# Altium schematic sheet schematic_A.SchDoc: AD9913, AD8302 Interface
size A4; SheetNumber: 1; SheetTotal: 3
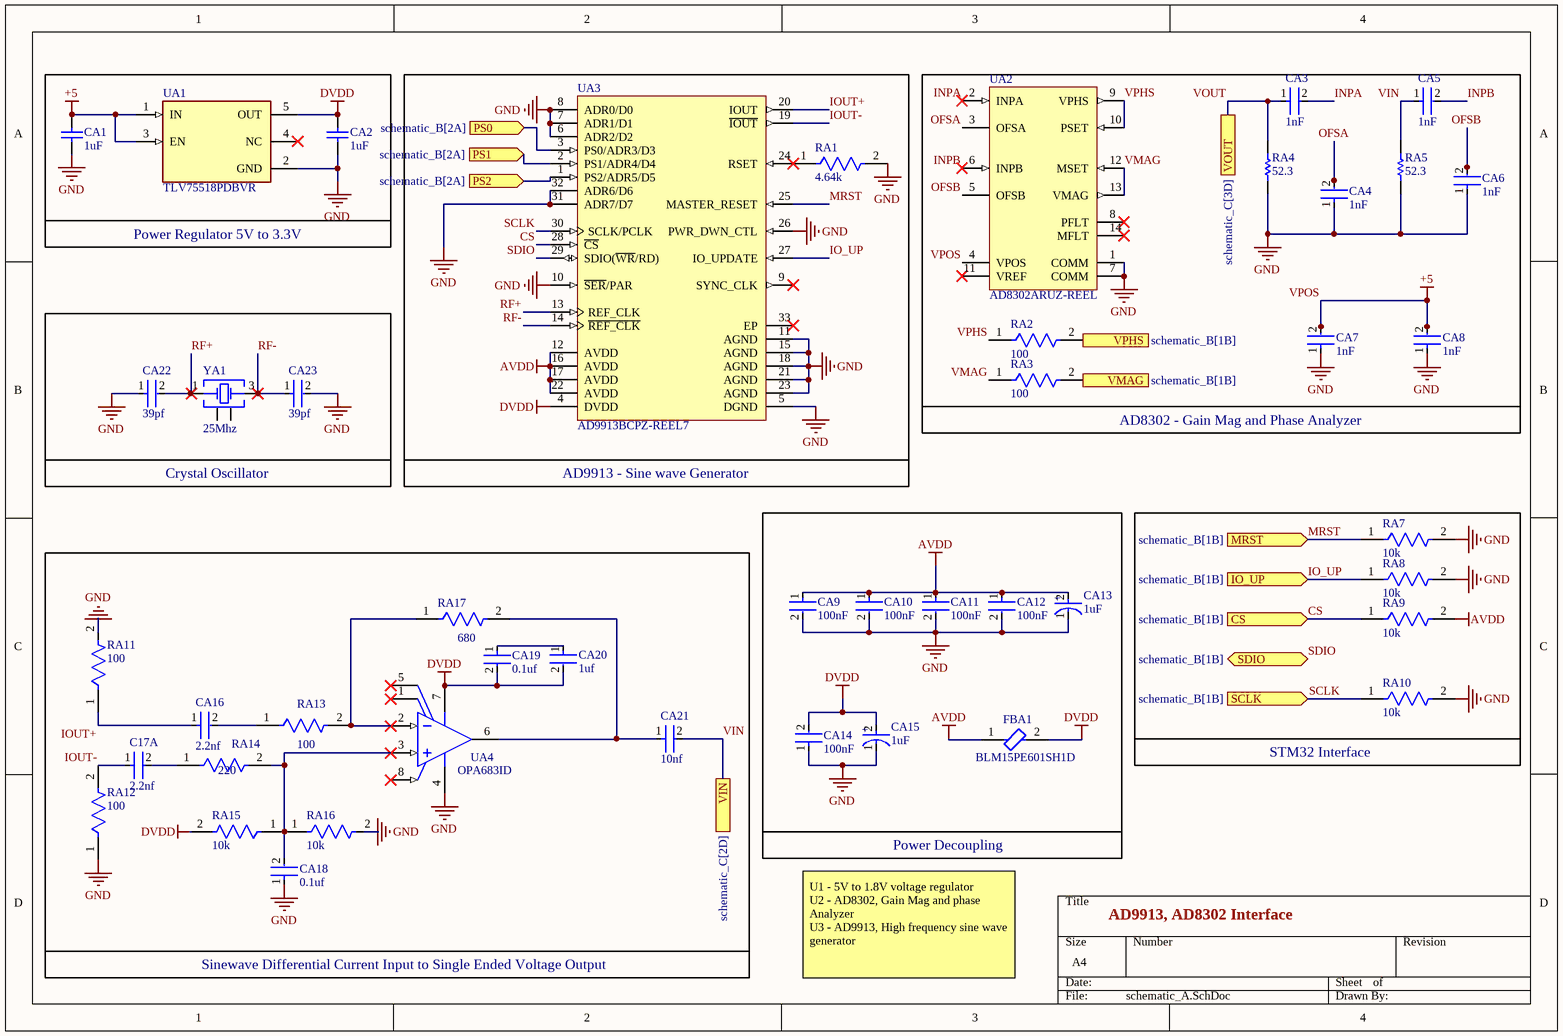
[diagram p0: schematic_A.SchDoc]

## Parts
C17A  2.2nf  [FP-GCM188-0_1-MFG]
CA1  1uF  [CAPC0603X33X15NL03T05]
CA2  1uF  [CAPC0603X33X15NL03T05]
CA3  1nF  [FP-CC0201-BA-MFG]
CA4  1nF  [FP-CC0201-BA-MFG]
CA5  1nF  [FP-CC0201-BA-MFG]
CA6  1nF  [FP-CC0201-BA-MFG]
CA7  1nF  [FP-CC0201-BA-MFG]
CA8  1nF  [FP-CC0201-BA-MFG]
CA9  100nF  [FP-0402-L_1_0_0_05-W_0_5-MFG]
CA10  100nF  [FP-0402-L_1_0_0_05-W_0_5-MFG]
CA11  100nF  [FP-0402-L_1_0_0_05-W_0_5-MFG]
CA12  100nF  [FP-0402-L_1_0_0_05-W_0_5-MFG]
CA13  1uF  [FP-293DA-MFG]
CA14  100nF  [FP-0402-L_1_0_0_05-W_0_5-MFG]
CA15  1uF  [FP-293DA-MFG]
CA16  2.2nf  [FP-GCM188-0_1-MFG]
CA18  0.1uf  [FP-GRM188-0_1-e0_2_0_5-MFG]
CA19  0.1uf  [FP-GRM188-0_1-e0_2_0_5-MFG]
CA20  1uf  [FP-CGA3E-0_3-0_1-IPC_B]
CA21  10nf  [FP-GRM022-0_02-IPC_B]
CA22  39pf  [FP-GRM033-0_03-IPC_A]
CA23  39pf  [FP-GRM033-0_03-IPC_A]
FBA1  BLM15PE601SH1D  [FP-BLM15-0_05-MFG]
RA1  4.64k  [FP-RN731J-MFG]
RA2  100  [FP-RNCP0603-MFG]
RA3  100  [FP-RNCP0603-MFG]
RA4  52.3  [RESC1005X35X20LL05T10]
RA5  52.3  [RESC1005X35X20LL05T10]
RA7  10k  [FP-CRGCQ0402-IPC_C]
RA8  10k  [FP-CRGCQ0402-IPC_C]
RA9  10k  [FP-CRGCQ0402-IPC_C]
RA10  10k  [FP-CRGCQ0402-IPC_C]
RA11  100  [FP-RNCP0603-MFG]
RA12  100  [FP-RNCP0603-MFG]
RA13  100  [FP-RNCP0603-MFG]
RA14  220  [FP-MCT0603-IPC_A]
RA15  10k  [FP-AT0805-MFG]
RA16  10k  [FP-AT0805-MFG]
RA17  680  [FP-RT0402-MFG]
UA1  TLV75518PDBVR  [FP-DBV0005A-IPC_A]
UA2  AD8302ARUZ-REEL  [ADI-RU-14_M]
UA3  AD9913BCPZ-REEL7  [ADI-CP-32-2_L]
UA4  OPA683ID  [D0008A_L]
YA1  25Mhz  [WE-XTAL_CFPX-180]

## Ports
CS (in, see schematic_B[1B]), IO_UP (in, see schematic_B[1B]), MRST (in, see schematic_B[1B]), PS0 (in, see schematic_B[2A]), PS1 (in, see schematic_B[2A]), PS2 (in, see schematic_B[2A]), SCLK (in, see schematic_B[1B]), SDIO (bidir, see schematic_B[1B]), VIN (see schematic_C[2D]), VMAG (out, see schematic_B[1B]), VOUT (see schematic_C[3D]), VPHS (out, see schematic_B[1B])

## Nets
AVDD: CA9.1 CA10.1 CA11.1 CA12.1 CA13.2(A) FBA1.1 RA9.2 UA3.12(AVDD) UA3.16(AVDD) UA3.17(AVDD) UA3.22(AVDD)
DVDD: CA2.1 CA14.2 CA15.2(A) CA19.2 CA20.2 FBA1.2 RA15.2 UA1.5(OUT) UA3.4(DVDD) UA4.7(VS+)
GND: CA1.2 CA2.2 CA4.1 CA6.1 CA7.1 CA8.1 CA9.2 CA10.2 CA11.2 CA12.2 CA13.1(C) CA14.1 CA15.1(C) CA18.1 CA22.1 CA23.2 RA1.2 RA4.1 RA5.1 RA7.2 RA8.2 RA10.2 RA11.2 RA12.1 RA16.2 UA1.2(GND) UA2.1(COMM) UA2.7(COMM) UA3.5(DGND) UA3.6(ADR2/D2) UA3.7(ADR1/D1) UA3.8(ADR0/D0) UA3.10(~{SER}/PAR) UA3.11(AGND) UA3.15(AGND) UA3.18(AGND) UA3.21(AGND) UA3.23(AGND) UA3.26(PWR_DWN_CTL) UA3.31(ADR7/D7) UA3.32(ADR6/D6) UA4.4(VS-)
VPOS: CA1.1 CA7.2 CA8.2 UA1.1(IN) UA1.3(EN) UA2.4(VPOS)  [also labelled +5]
CS: RA9.1 UA3.28(~{CS}) ; port CS
INPA: CA3.2 UA2.2(INPA)
INPB: CA5.2 UA2.6(INPB)
IO_UP: RA8.1 UA3.27(IO_UPDATE) ; port IO_UP
IOUT+: CA16.1 RA11.1 UA3.20(IOUT)
IOUT-: C17A.1 RA12.2 UA3.19(~{IOUT})
MRST: RA7.1 UA3.25(MASTER_RESET) ; port MRST
OFSA: CA4.2 UA2.3(OFSA)
OFSB: CA6.2 UA2.5(OFSB)
PS0: UA3.3(PS0/ADR3/D3) ; port PS0
PS1: UA3.2(PS1/ADR4/D4) ; port PS1
PS2: UA3.1(PS2/ADR5/D5) ; port PS2
RF+: CA22.2 UA3.13(REF_CLK) YA1.1(Crystal)
RF-: CA23.1 UA3.14(~{REF_CLK}) YA1.3(Crystal)
SCLK: RA10.1 UA3.30(SCLK/PCLK) ; port SCLK
SDIO: UA3.29(SDIO(~{WR}/RD)) ; port SDIO
VIN: CA5.1 CA21.2 RA5.2 ; port VIN
VMAG: RA3.1 UA2.12(MSET) UA2.13(VMAG)
VMAG: RA3.2 ; port VMAG  [a separate net that carries the same name]
VOUT: CA3.1 RA4.2 ; port VOUT
VPHS: RA2.1 UA2.9(VPHS) UA2.10(PSET)
VPHS: RA2.2 ; port VPHS  [a separate net that carries the same name]
NetC17A_2: C17A.2 RA14.1
NetCA16_2: CA16.2 RA13.1
NetCA18_2: CA18.2 RA14.2 RA15.1 RA16.1 UA4.3(IN+)
NetCA19_1: CA19.1 CA20.1
NetCA21_1: CA21.1 RA17.2 UA4.6(OUT)
NetRA1_1: RA1.1 UA3.24(RSET)
NetRA13_2: RA13.2 RA17.1 UA4.2(IN-)

Not connected (* = marked no-connect by the designer): UA1 4(NC)*; UA2 8(PFLT)* 11(VREF)* 14(MFLT)*; UA3 9(SYNC_CLK)* 33(EP)*; UA4 1(NC)* 5(NC)* 8(~{DIS})*; YA1 2(GND&Lid) 4(GND&Lid)

## Notes on the sheet
- Power Regulator 5V to 3.3V
- AD8302 - Gain Mag and Phase Analyzer
- Crystal Oscillator
- AD9913 - Sine wave Generator
- (near RA10) STM32 Interface
- Power Decoupling
- Sinewave Differential Current Input to Single Ended Voltage Output
- U1 - 5V to 1.8V voltage regulator
  U2 - AD8302, Gain Mag and phase Analyzer
  U3 - AD9913, High frequency sine wave generator
- (in symbol CMP-00030-40018767-1) +

## Library data of the parts
C17A CA16 = CMP-06035-034799-1: Ceramic Capacitor for Automotive 2.2nF  ±5% 63VDC C0G 0603 Paper T/R
CA1 CA2 = CMP-2010-00160-1: Part Number: 02016D105KAT2A; Manufacturer: AVX Interconnect / Elco
CA3-CA8 = CMP-03422-000526-1: CC0201 1.0 nF X5R 10.00% 10 V; Manufacturer: Yageo; Manufacturer Part Number: CC0201KRX5R6BB102; Capacitance: 1.0 nF; Value: 1.0 nF; Voltage Rating: 10 V; Temperature Coefficient: 15%; Tolerance: 0.1; Automotive: No; Device Class L1: Passive Components; Octopart: https://octopart.com/cc0201krx5r6bb102-yageo-88172737; Device Class L2: Capacitors; Temperature Range Low: -55°C; ComponentLink2URL: http://www.yageo.com/documents/recent/UPY-GPHC_X5R_4V-to-50V_25.pdf; Ipc Land Pattern Name: CAPC6030X30; Material: Ceramic; Device Class L3: Ceramic Capacitors; Temperature: -55°C to +85°C; Package: CC0201-BA; Footprint Url: http://www.yageo.com/exep/pages/download/literatures/UPY-C_GEN_24.pdf; Temperature Range High: +85°C; RoHS: TRUE; ComponentLink2Description: Datasheet; Lead Free: Yes; Category: Cap; Height: 0.33mm; Temperature Characteristic: X5R
CA9-CA12 CA14 = CMP-14477-003271-3: Ceramic Capacitor General Use 0.1uF ±10% 25V X5R 0402; NexarPartId: 49252556; Max Thickness: 550µm; Min Operating Temperature: -55°C; Material: Ceramic; Capacitance: 100nF; Min Length: 950µm; Packaging: Tape & Reel (TR); Min Width: 450µm; Thickness: 558.8µm; Tolerance: 10%; Length: 990.6µm; Case/Package: 0402; Mount: Surface Mount; Height: 550µm; Max Length: 1.05mm; Halogen Free: Halogen Free; Voltage Rating: 25V; Max Operating Temperature: 85°C; Max Width: 550µm; Min Thickness: 450µm; RoHS: Compliant; Width: 508µm; Voltage Rating (DC): 25V
CA13 CA15 = CMP-00030-40018767-1: 293D105X9020A2TE3 Cap Tant Solid 1uF 20V A CASE 10% (3.2 X 1.6 X 1.6mm) SMD 3216-18 8.4 Ohm 125 C T/R; Leakage Current: 500nA; Capacitance: 1µF; Dissipation Factor: 4%; Polarity: Polar; Dielectric Material: Tantalum; ESR (Equivalent Series Resistance): 8.4Ω; Tolerance: 20%; Ripple Current: 90mA; Q Factor: 4; Width: 1.6mm; Radiation Hardening: No; REACH SVHC: Unknown; Packaging: Tape and Reel; Max Operating Temperature: 125°C; Voltage Rating (DC): 20V; Features: General Purpose; Case Code (Imperial): 1206; Schedule B: 8532210050, 8532210050; Mount: PCB, Surface Mount; NexarPartId: 40018767; Length: 3.2mm; Depth: 1.6mm; Height - Seated (Max): 1.8034mm; Termination: SMD/SMT; Case/Package: 3216-18; Min Operating Temperature: -55°C; RoHS: Compliant; Voltage Rating: 20V; Height: 1.6mm; Number of Pins: 2; Case Code (Metric): 3216; Lead Free: Lead Free; Voltage: 20V
CA18 CA19 = CMP-06035-009454-1: Chip Multilayer Ceramic Capacitors for General Purpose, 0603, 0.10uF, X7R, 15%, 20%, 100V; Capacitance: 100nF; Voltage Rating (DC): 100V; Dielectric: X7R; Width: 800um; Tolerance: 20%; Thickness: 800um; Length: 1.6mm
CA20 = CMP-08246-001878-1: Cap Ceramic 1uF 25V X7R 20% Pad SMD 0603 +125°C Automotive T/R; Case Code (Metric): 1608; Case Code (Imperial): 0603; Dielectric: X7R; Voltage Rating (DC): 25V; Max Operating Temperature: 125°C; Weight: 7.1E-05oz; Height: 0.8mm; Thickness: 0.031inch; Voltage Rating: 25V; Ratings: AEC-Q200; Mount: Surface Mount; Package Quantity: 4000; Min Operating Temperature: -55°C; Length: 0.063inch; Packaging: Tape and Reel; Tolerance: 20%; Case/Package: 0603; Width: 0.031inch; Capacitance: 1uF
CA21 = CMP-06035-063197-1: Chip Multilayer Ceramic Capacitors for General Purpose, 10000pF ±20%, X6S(EIA), ±22.0%, 4Vdc, 01005 (0402M)
CA22 CA23 = CMP-2010-01365-2: Chip Multilayer Ceramic Capacitors for General Purpose, 0201, 39pF, C0G, 30ppm/°C, 5%, 25V; Max Operating Temperature: 125°C; Package Quantity: 15000; Tolerance: 5%; Voltage Rating (DC): 25V; Case/Package: 0201; Capacitance: 39pF; Thickness: 0.013inch; Termination: SMD/SMT; Length: 0.6mm; Width: 0.012inch; Packaging: Tape and Reel; Voltage Rating: 25V; Case Code (Metric): 0603; Height: 0.3mm; Lead Free: Lead Free; Min Operating Temperature: -55°C; Depth: 0.3mm; Mount: Surface Mount; Case Code (Imperial): 0201; Dielectric: C0G
FBA1 = CMP-00260-117051428-1: BLM15PE601SH1D Ferrite Bead, 600 Ohm, 25%, 0402 Rohs Compliant: Yes; Test Frequency: 100MHz; Resistance: 400mΩ; RMS Current (Irms): 700mA; Tolerance: 25%; Height: 550µm; Lifecycle Status: Production; NexarPartId: 117051428; Case/Package: 0402; Min Operating Temperature: -55°C; Series Resistance: 400mΩ; Max Operating Temperature: 125°C; Core Material: Ferrite
RA1 = CMP-03211-005291-1: Thin Film Resistors RN 0603 4.64KΩ 0.1% 10ppm/°C; Manufacturer: TE Connectivity; Manufacturer Part Number: RN73C1J4K64BTG; Voltage Rating: 50V; Power Rating: 0.063W; ComponentLink2URL: https://www.te.com/commerce/DocumentDelivery/DDEController?Action=showdoc&DocId=Data+Sheet%7F1773270%7FP%7Fpdf%7FEnglish%7FENG_DS_1773270_P.pdf%7F9-1614352-9; Resistance: 4.64KΩ; Temperature Coefficient: 10ppm/°C; Tolerance: 0.1%; packaging: 250 cut tape length; Series: RN73; Value: 4.64KΩ; Category: Res; Composition: Thin Film; Device Class L3: Chip SMD Resistors; Octopart: https://octopart.com/rn73c1j4k64btg-te+connectivity-44606189; Device Class L1: Passive Components; Temperature: -55°C to +155°C; Ipc Land Pattern Name: RESC15580X45; Lead Free: Yes; Temperature Range High: +155°C; ComponentLink2Description: Datasheet; Temperature Range Low: -55°C; octopart_url: https://octopart.com/rn73c1j4k64btg-te+connectivity-44606189; Device Class L2: Resistors; RoHS: TRUE; Package: RN731J; Automotive: No; Height: 0.55mm
RA2 RA3 RA11-RA13 = CMP-26527-000148-1: 100Ω ±1% 0.125W 0603 High Power Anti-Sulfur Thin Film Chip Resistor; Resistance: 100R; Temperature Coefficient: 100ppm/°C; Max Power Dissipation: 125mW; Features: Moisture Resistant; Packaging: Tape and Reel; Lead Free: Lead Free; Height: 0.02inch; Series: RNCP; Contact Plating: Tin; Resistor Type: Thin Film; Case Code (Imperial): 0603; Case Code (Metric): 1608; Min Operating Temperature: -55°C; Length: 0.059inch; Number of Terminations: 2; RoHS Compliant: Yes; Tolerance: 1%; Width: 0.031inch; Max Operating Temperature: 155°C; Case/Package: 0603; Mount: Surface Mount; Radiation Hardening: No
RA4 = CMP-2002-03468-1: Part Number: 1879125-6; Manufacturer: TE Connectivity / AMP
RA5 = CMP-2002-03468-1: Part Number: 1879125-6; Manufacturer: TE Connectivity / AMP; Manufacturer Part Number: TNPW040252R3BEED; Max Power Dissipation: 63mW; Power Rating: 100mW; Value: 52.3Ω; Temperature Coefficient: 25ppm/°C; Tolerance: 0.1%; Voltage Rating: 50V; Supplier: DigiKey; Supplier Part Number: 541-4503-1-ND; RoHS: Compliant; Category: Chip SMD Resistors; Stock: 543; Pricing: 1=0.23, 10=0.192, 25=0.178, 50=0.1682, 100=0.159, 250=0.14776, 500=0.1401, 1000=0.13317, 5000=0.1224 (USD); Case/Package: 0402; China RoHS: Compliant; Composition: Thin Film; Country of Origin: Germany, Israel; Export Control Classification Number (ECCN) Code: EAR99; Features: Anti-Sulfur, Automotive AEC-Q200, Moisture Resistant; Height: 350µm; Harmonized Tariff Schedule (HTS) Code: 8533.21.00.30; Introduction Date: 2006-07-14; Length: 1mm; Lifecycle Status: Production; Max Operating Temperature: 125°C; Min Operating Temperature: -55°C; Mounting Technology: Surface Mount; Number of Terminals: 2; Number of Terminations: 2; Packaging: Tape & Reel (TR); Power Dissipation: 63mW; REACH SVHC: Yes; Width: 500µm; Working Voltage: 50V; ComponentLink1URL: https://datasheet.octopart.com:443/TNPW040252R3BEED-Vishay-datasheet-182188515.pdf?src-supplier=IHS; ComponentLink1Description: https://datasheet.octopart.com:443/TNPW040252R3BEED-Vishay-datasheet-182188515.pdf?src-supplier=IHS; ComponentLink2URL: https://datasheet.octopart.com:443/TNPW040252R3BEED-Vishay-Dale-datasheet-182026744.pdf?src-supplier=IHS; ComponentLink2Description: https://datasheet.octopart.com:443/TNPW040252R3BEED-Vishay-Dale-datasheet-182026744.pdf?src-supplier=IHS; ComponentLink3URL: https://datasheet.octopart.com:443/TNPW040252R3BEED-Vishay-Dale-datasheet-79783896.pdf?src-supplier=Upverter; ComponentLink3Description: https://datasheet.octopart.com:443/TNPW040252R3BEED-Vishay-Dale-datasheet-79783896.pdf?src-supplier=Upverter; ComponentLink4URL: https://datasheet.octopart.com/TNPW040252R3BEED-Vishay-datasheet-13498837.pdf; ComponentLink4Description: https://datasheet.octopart.com/TNPW040252R3BEED-Vishay-datasheet-13498837.pdf; ComponentLink5URL: https://datasheet.octopart.com/TNPW040252R3BEED-Vishay-datasheet-13414878.pdf; ComponentLink5Description: https://datasheet.octopart.com/TNPW040252R3BEED-Vishay-datasheet-13414878.pdf; ComponentLink6URL: https://datasheet.octopart.com/TNPW040252R3BEED-Vishay-datasheet-13295955.pdf; ComponentLink6Description: https://datasheet.octopart.com/TNPW040252R3BEED-Vishay-datasheet-13295955.pdf; ComponentLink7URL: https://datasheet.octopart.com/TNPW040252R3BEED-Vishay-datasheet-13196373.pdf; ComponentLink7Description: https://datasheet.octopart.com/TNPW040252R3BEED-Vishay-datasheet-13196373.pdf; ComponentLink8URL: https://datasheet.octopart.com/TNPW040252R3BEED-Vishay-datasheet-13143890.pdf; ComponentLink8Description: https://datasheet.octopart.com/TNPW040252R3BEED-Vishay-datasheet-13143890.pdf; ComponentLink9URL: https://datasheet.octopart.com/TNPW040252R3BEED-Vishay-datasheet-13081780.pdf; ComponentLink9Description: https://datasheet.octopart.com/TNPW040252R3BEED-Vishay-datasheet-13081780.pdf; ComponentLink10URL: https://datasheet.octopart.com/TNPW040252R3BEED-Vishay-datasheet-13052401.pdf; ComponentLink10Description: https://datasheet.octopart.com/TNPW040252R3BEED-Vishay-datasheet-13052401.pdf; ComponentLink11URL: https://datasheet.octopart.com/TNPW040252R3BEED-Vishay-datasheet-13034137.pdf; ComponentLink11Description: https://datasheet.octopart.com/TNPW040252R3BEED-Vishay-datasheet-13034137.pdf; ComponentLink12URL: https://datasheet.octopart.com/TNPW040252R3BEED-Vishay-datasheet-12585086.pdf; ComponentLink12Description: https://datasheet.octopart.com/TNPW040252R3BEED-Vishay-datasheet-12585086.pdf; ComponentLink13URL: https://datasheet.octopart.com/TNPW040252R3BEED-Vishay-datasheet-12543131.pdf; ComponentLink13Description: https://datasheet.octopart.com/TNPW040252R3BEED-Vishay-datasheet-12543131.pdf; ComponentLink14URL: https://datasheet.octopart.com/TNPW040252R3BEED-Vishay-datasheet-12532511.pdf; ComponentLink14Description: https://datasheet.octopart.com/TNPW040252R3BEED-Vishay-datasheet-12532511.pdf; ComponentLink15URL: https://datasheet.octopart.com/TNPW040252R3BEED-Vishay-datasheet-12519971.pdf; ComponentLink15Description: https://datasheet.octopart.com/TNPW040252R3BEED-Vishay-datasheet-12519971.pdf; ComponentLink16URL: https://datasheet.octopart.com/TNPW040252R3BEED-Vishay-datasheet-12509767.pdf; ComponentLink16Description: https://datasheet.octopart.com/TNPW040252R3BEED-Vishay-datasheet-12509767.pdf; ComponentLink17URL: https://datasheet.octopart.com/TNPW040252R3BEED-Vishay-datasheet-12365287.pdf; ComponentLink17Description: https://datasheet.octopart.com/TNPW040252R3BEED-Vishay-datasheet-12365287.pdf; ComponentLink18URL: https://datasheet.octopart.com/TNPW040252R3BEED-Vishay-datasheet-10854096.pdf; ComponentLink18Description: https://datasheet.octopart.com/TNPW040252R3BEED-Vishay-datasheet-10854096.pdf; ComponentLink19URL: https://datasheet.octopart.com/TNPW040252R3BEED-Vishay-datasheet-10678752.pdf; ComponentLink19Description: https://datasheet.octopart.com/TNPW040252R3BEED-Vishay-datasheet-10678752.pdf; ComponentLink20URL: https://datasheet.octopart.com/TNPW040252R3BEED-Vishay-datasheet-10283461.pdf; ComponentLink20Description: https://datasheet.octopart.com/TNPW040252R3BEED-Vishay-datasheet-10283461.pdf; ComponentLink21URL: https://datasheet.octopart.com/TNPW040252R3BEED-Vishay-datasheet-10185418.pdf; ComponentLink21Description: https://datasheet.octopart.com/TNPW040252R3BEED-Vishay-datasheet-10185418.pdf; ComponentLink22URL: https://datasheet.octopart.com/TNPW040252R3BEED-Vishay-datasheet-10055244.pdf; ComponentLink22Description: https://datasheet.octopart.com/TNPW040252R3BEED-Vishay-datasheet-10055244.pdf; ComponentLink23URL: http://sigma.octopart.com:80/rohs_statement/Vishay-company-15.pdf?src-supplier=Compliance+Statements; ComponentLink23Description: http://sigma.octopart.com:80/rohs_statement/Vishay-company-15.pdf?src-supplier=Compliance+Statements
RA7-RA10 = CMP-03211-008081-1: CRGCQ 0402 10K 5%; Manufacturer: TE Connectivity; Manufacturer Part Number: CRGCQ0402J10K; Power Rating: 0.0625W; Tolerance: 0.05; Voltage Rating: 50V; Temperature Coefficient: ±100ppm/°C; Resistance: 10KΩ; Value: 10KΩ; RoHS: TRUE; Octopart: https://octopart.com/crgcq0402j10k-te+connectivity-91017993; ComponentLink2URL: https://www.te.com/commerce/DocumentDelivery/DDEController?Action=showdoc&DocId=Data+Sheet%7F1773204-3%7F1%7Fpdf%7FEnglish%7FENG_DS_1773204-3_1.pdf%7F4-2176347-923; Package: CRGCQ0402; Mouser Description: Res Thick Film 0402 10K Ohm 5% 0.063W(1/16W) ±100ppm/C Pad SMD Automotive T/R; Temperature Range High: +155°C; Composition: Thick Film; Automotive: Yes; Category: Res; Temperature Range Low: -55°C; Height: 0.4mm; Device Class L3: Chip SMD Resistors; Device Class L2: Resistors; Digikey Description: CRGCQ 0402 10K 5%; Ambient Temperature Range High: +70°C; Device Class L1: Passive Components; Lead Free: Yes; ComponentLink2Description: Datasheet; Temperature: -55°C to +155°C; Series: CRGCQ; Ipc Land Pattern Name: RESC10050X35
RA14 = CMP-02407-001561-1: RES SMD 100 OHM 1% 1/8W 0603; Tolerance: 0.5%; Resistance: 220R; Depth: 0.85mm; Packaging: Tape and Reel; Max Operating Temperature: 125°C; Composition: Thin Film; Min Operating Temperature: -55°C; Military Standard: Not; Length: 1.55mm; Lead Free: Lead Free; Case/Package: 0603
RA15 RA16 = CMP-03412-049031-1: Thin Film Chip Resistors Automotive Grade 10kΩ 0.5% 50ppm/°C 0805; Max Power Dissipation: 125mW; Resistance: 10kR; Ratings: AEC-Q200; Length: 0.079inch; Temperature Coefficient: 50ppm/°C; Height: 0.024inch; Min Operating Temperature: -55°C; Case/Package: 0805; Tolerance: 0.5%; RoHS Compliant: Yes; Features: Moisture Resistant; Number of Terminations: 2; Max Operating Temperature: 155°C; Series: AT; Packaging: Tape and Reel; Width: 0.049inch; Resistor Type: Thin Film
RA17 = CMP-2002-02566-2: RES SMD 680 OHM 1% 1/16W 0402; Manufacturer Part Number: RT0402FRE07680RL; Manufacturer: Yageo; Temperature Coefficient: 50 ppm/°C; Resistance: 680Ω; Tolerance: 0.01; Power Rating: 0.063W; Voltage Rating: 50V; Value: 680Ω; Automotive: No; Digikey Description: RES SMD 680 OHM 1% 1/16W 0402; RoHS: TRUE; Package: RT0402; Composition: Thin Film; Ipc Land Pattern Name: RESC10050X30; Temperature Range Low: -55°C; Octopart: https://octopart.com/rt0402fre07680rl-yageo-1234572; Temperature Range High: +155°C; ComponentLink2Description: Datasheet; Temperature: -55°C to +155°C; Device Class L3: Chip SMD Resistors; Height: 0.35mm; Category: Res; Series: RT; Mouser Description: Res Thin Film 0402 680 Ohm 1% 1/16W ±50ppm/°C Molded SMD SMD Paper T/R; Lead Free: Yes; Device Class L1: Passive Components; Footprint Url: http://www.yageo.com/exep/pages/download/literatures/PYu-R_Mount_10.pdf; ComponentLink2URL: http://www.yageo.com/documents/recent/PYu-RT_1-to-0.01_RoHS_L_9.pdf; Device Class L2: Resistors
UA1 = CMP-04917-000157-1: IC REG LINEAR 1.8V 500MA SOT23-5; Output Configuration: Positive; Dropout Voltage: 400mV; Output Type: Fixed; Power Supply Rejection Ratio (PSRR): 52dB; Number of Regulators: 1; Quiescent Current: 31uA; Max Input Voltage: 5.5V; Max Output Voltage: 3.3V; Mount: Surface Mount; Min Operating Temperature: -40°C; Output Current: 500mA; Min Output Voltage: 1.8V; Packaging: Cut Tape; Max Operating Temperature: 125°C; Case/Package: SOT-23-5
UA2 = CMP-0284-00077-1: LF-2.7 GHz RF/IF Gain and Phase Detector, 60ns Response Time, RU-14, Pb-Free, 2500 Reel; Supply Current: 19mA; Product Description: Dual-Channel Gain and Phase Outputs; Temp Stability (dB): 1dB; Voltage Supply (V): 2.7 to 5.5; Dynamic Range (dB): 60dB; RF Frequency (MHz): 2700; PackageDescription: 14-Lead Thin Shrink Small Outline Package [TSSOP]; PackageVersion: Aug-2002; ComponentLink3Description: Package Specification; ComponentLink2Description: Datasheet; ComponentLink1URL: www.analog.com; Code_JEDEC: MO-153AB-1; Response Time (ns typ): 60ns; ComponentLink1Description: Manufacturer URL; ComponentLink3URL: http://www.analog.com/static/imported-files/packages/36057385283879153717235186773RU14.pdf; ComponentLink2URL: http://www.analog.com/static/imported-files/data_sheets/AD8302.pdf; DatasheetVersion: Rev. A; PackageReference: RU-14
UA3 = CMP-0293-00008-1: Low Power 250 MSPS 10-Bit DAC 1.8 V CMOS Direct Digital Synthesizer, Parallel, Serial, CP-32-2, 1500 Reel, Pb-Free; Resolution (Bits): 10bit; REFCLK Multiplier: Yes; I Supply total (max): 63.5mA; FS Iout (mA nom): 4.6mA; Tuning Word Width (bits): 32bit; Compliance Range (V): 800mV; Master fclk: 250MHz; PackageReference: CP-32-2; ComponentLink1Description: Manufacturer URL; ComponentLink2Description: Datasheet; DatasheetVersion: Rev. A; ComponentLink3Description: Package Specification; ComponentLink3URL: http://www.analog.com/static/imported-files/packages/414143737956480539664569CP_32_2.pdf; I/O Interface: Parallel, Serial; PackageDescription: 32-Lead Lead Frame Chip Scale Package [LFCSP_VQ]; ComponentLink2URL: http://www.analog.com/static/imported-files/data_sheets/AD9913.pdf; ComponentLink1URL: www.analog.com; Code_JEDEC: MO-220-VHHD-2; PackageVersion: Jan-2005
UA4 = CMP-0018-00250-2: Very Low Power Current Feedback Amplifier with Disable, 5 to 12 V, -40 to 85 degC, 8-pin SOIC (D8), Green (RoHS & no Sb/Br); Manufacturer: Texas Instruments; Acl, min stable gain(V/V): 1; THD (Fc is 1 MHz)(Typ)(dB): -90; Settling Time (0.1%)(Typ)(ns): 12; Diff Phase(deg): 0.06; 3rd Harmonic(dBc): 88; Diff Gain(%): 0.13; Sub Family: High Output Current Amplifier (>=50mA), High Speed Amplifier (>=50MHz); Iib(Max)(nA): 5300; Vio(Max)(mV): 3.5; Iq per channel(Max)(mA): 1.03; @ MHz: 5; Slew Rate(Typ)(V/us): 400; Io(Typ)(mA): 110; Vn at Flatband(Typ)(nV/rtHz): 4.4; BW @ Acl(MHz): 200; 2nd Harmonic(dBc): 72; Mounting Technology: Surface Mount; PackageReference: D0008A; ComponentLink3URL: http://www.ti.com/litv/pdf/msoi002j; Code_JEDEC: MS-012; ComponentLink1URL: http://www.ti.com/; Number of Channels: 1; DatasheetVersion: SBOS221E; ComponentLink2Description: Datasheet; Vs(Max)(V): 12; Eco-Plan: Green (RoHS & no Sb/Br); ComponentLink3Description: Package Specification; ComponentLink2URL: http://www.ti.com/general/docs/lit/getliterature.tsp?genericPartNumber=OPA683&fileType=pdf; PackageVersion: 4040047-3/M, 06/2011; ComponentLink1Description: Manufacturer URL; PartNumber: OPA683ID; PackageDescription: 8-Pin Plastic Small Outline, Body 4.9 x 3.9 mm, Pitch 1.27 mm; Vs(Min)(V): 5
YA1 = CMP-03913-116855753-1: 830108174209 WE-XTAL Quartz Crystal; NexarPartId: 116855753; Height: 800µm; Max Operating Temperature: 85°C; Width: 2.5mm; Length: 3.2mm; Min Operating Temperature: -40°C; Frequency: 25MHz